# EAGLE design WG12864A (EAGLE 5.03)
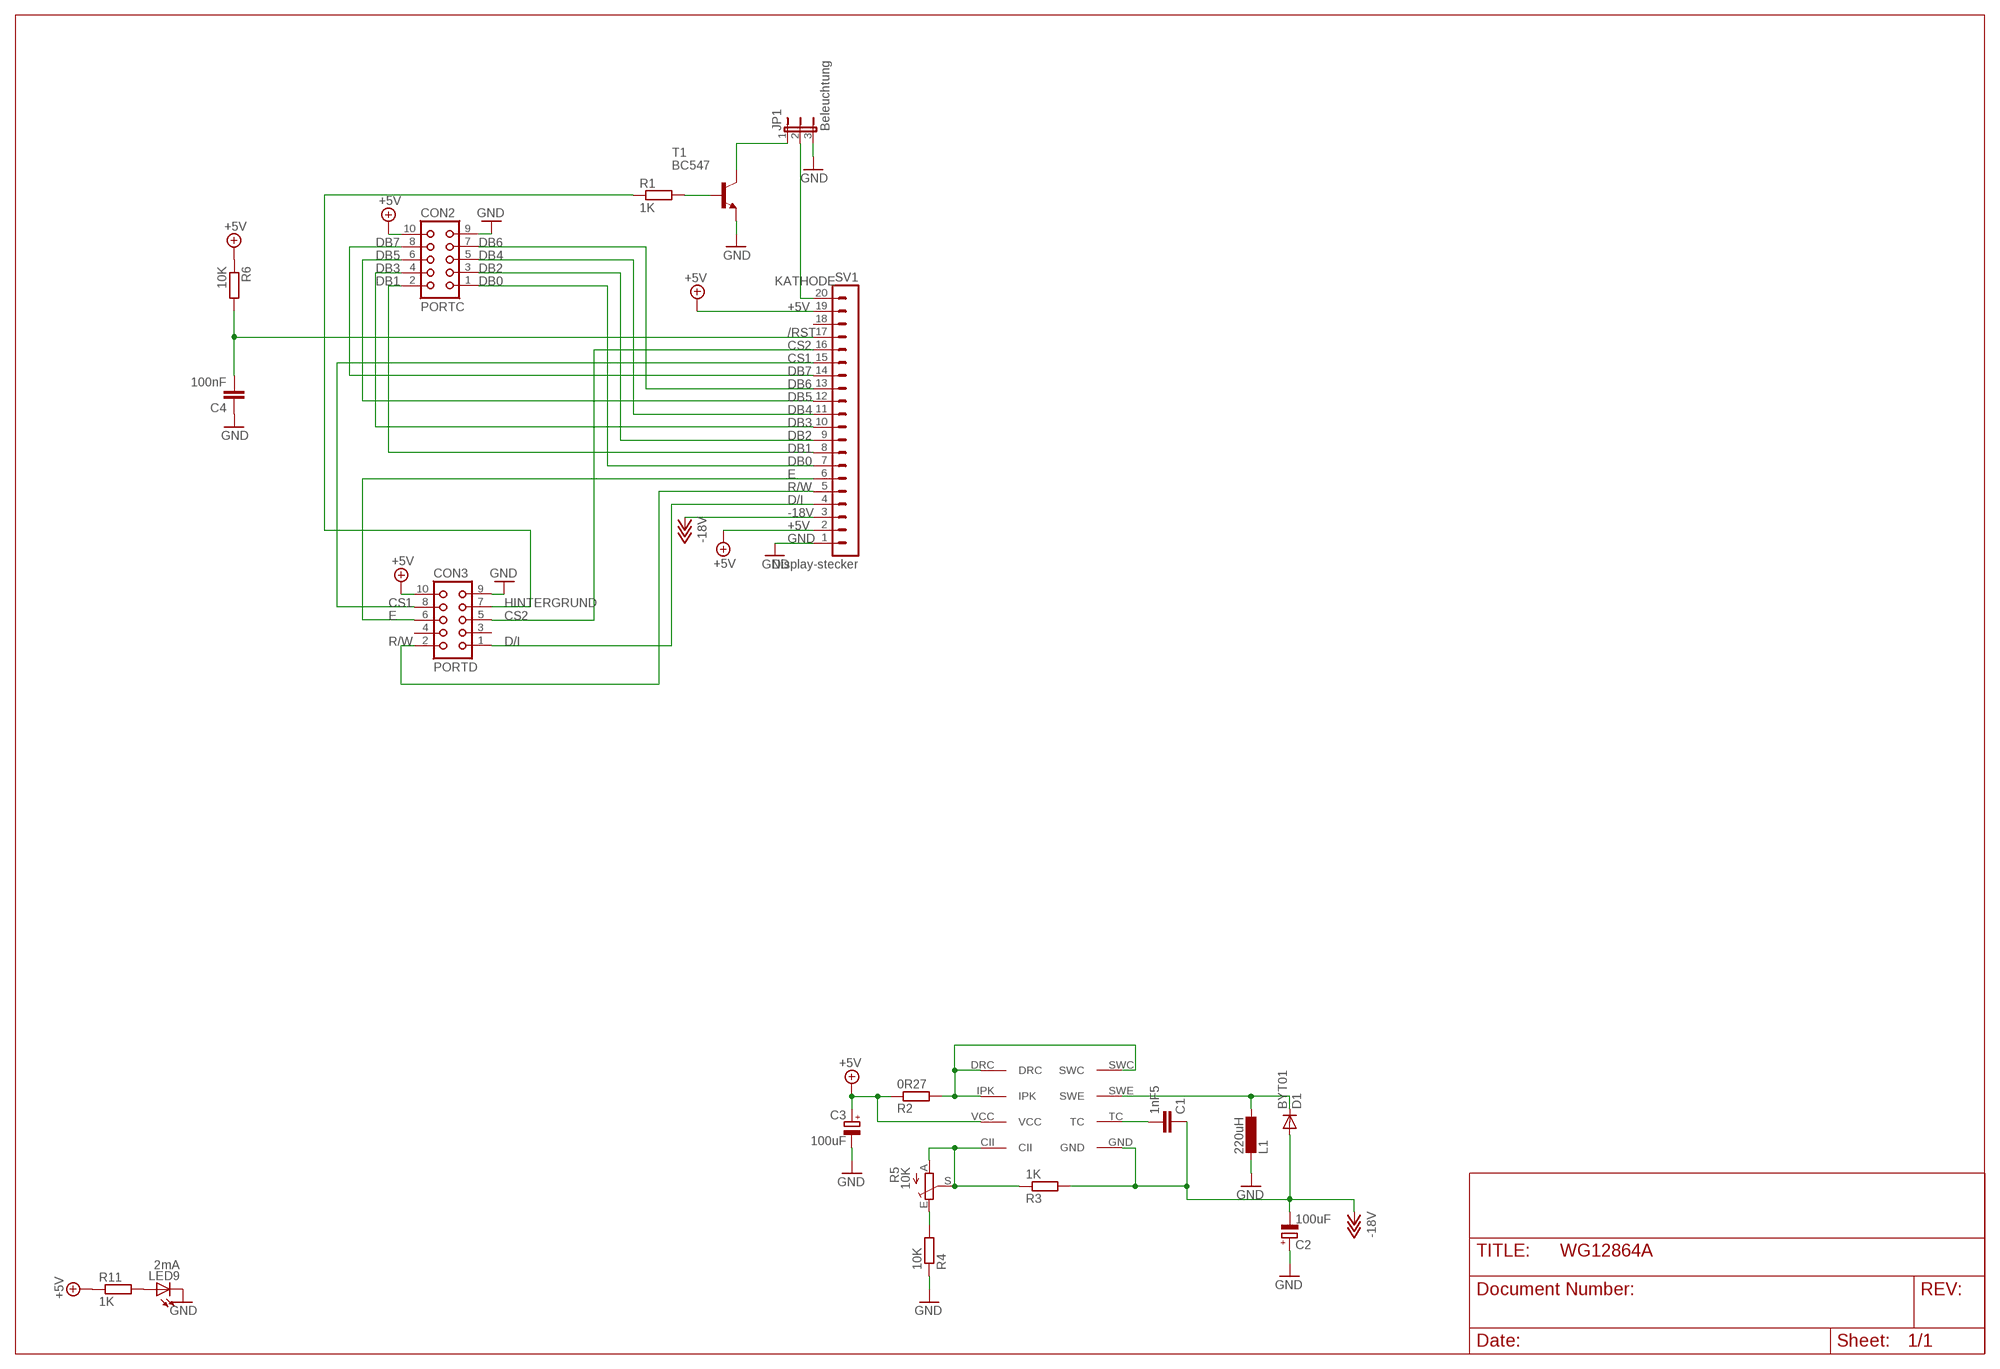
[diagram p0: schematic, sheet 1]

## Parts
C1  1nF5  C-EU025-024X044  [C025-024X044]
C2  100uF  CPOL-EUE5-8.5  [E5-8,5]
C3  100uF  CPOL-EUE5-8.5  [E5-8,5]
C4  100nF  C-EU025-024X044  [C025-024X044]
CON2  PORTC  CON10  [CON10]
CON3  PORTD  CON10  [CON10]
D1  BYT01  [F126-10]
JP1  Beleuchtung  JP2E  [JP2]
L1  220uH  L-EU0204/7  [0204/7]
LED9  2mA  LED3MM  [LED3MM]
R1  1K  R-EU_0204/7  [0204/7]
R2  0R27  R-EU_0204/7  [0204/7]
R3  1K  R-EU_0204/7  [0204/7]
R4  10K  R-EU_0204/7  [0204/7]
R5  10K  TRIM_EU-CA6V  [CA6V]
R6  10K  R-EU_0204/7  [0204/7]
R11  1K  R-EU_0204/2V  [0204V]
SV1  Display-stecker  MA20-1  [MA20-1]
T1  BC547  -NPN-TO92  [TO92]
U$2  MC34063  [MC34063]

## Nets
+5V: C3.+ CON2.10 CON3.10 R2.1 R6.1 R11.1 SV1.2 SV1.19 U$2.VCC
-18V: C1.1 C2.- D1.A R3.2 SV1.3 U$2.GND
/RST: C4.2 R6.2 SV1.17
CS1: CON3.8 SV1.15
CS2: CON3.5 SV1.16
D/I: CON3.1 SV1.4
DB0: CON2.1 SV1.7
DB1: CON2.2 SV1.8
DB2: CON2.3 SV1.9
DB3: CON2.4 SV1.10
DB4: CON2.5 SV1.11
DB5: CON2.6 SV1.12
DB6: CON2.7 SV1.13
DB7: CON2.8 SV1.14
E: CON3.6 SV1.6
GND: C2.+ C3.- C4.1 CON2.9 CON3.9 JP1.3 L1.2 LED9.K(C) R4.1 SV1.1 T1.1(E)
HINTERGRUND: CON3.7 R1.1
KATHODE: JP1.2 SV1.20
N$1: R1.2 T1.2(B)
N$3: LED9.A R11.2
N$21: R2.2 U$2.DRC U$2.IPK U$2.SWC
N$22: R3.1 R5.A R5.S U$2.CII
N$23: R4.2 R5.E
N$24: D1.C L1.1 U$2.SWE
N$25: C1.2 U$2.TC
N$30: JP1.1 T1.3(C)
R/W: CON3.2 SV1.5
Unconnected: CON3.3 CON3.4 SV1.18

## Library data of the parts
C1 C4 = rcl:C-EU: CAPACITOR, European symbol
C2 C3 = rcl:CPOL-EU: POLARIZED CAPACITOR, European symbol
CON2 CON3 = con-harting:CON10: CONNECTOR
D1 = diode:BYT01: DIODE ultra fast
JP1 = jumper:JP2E: JUMPER
L1 = rcl:L-EU: INDUCTOR, European symbol
LED9 = led:LED: LED OSRAM: - CHIPLED LG R971, LG N971, LY N971, LG Q971, LY Q971, LO R971, LY R971 LH N974, LH R974 LS Q976, LO Q976, LY Q976 LO Q996 - Hyper CHIPLED LW Q18S LB Q993, LB Q99A, LB R99A - SideLED LS A670, LO A670, LY A670, LG A670, LP A670 LB A673, LV A673, LT A673, LW A673 LH A674 LY A675 LS A676, LA A676, LO A676, LY A676, LW A676 LS A679, LY A679, LG A679 - Hyper Micro SIDELED® LS Y876, LA Y876, LO Y876, LY Y876 LT Y87S - SmartLED LW L88C, LW L88S LB L89C, LB L89S, LG L890 LS L89K, LO L89K, LY L89K LS L896, LA L896, LO L896, LY L896 - TOPLED LS T670, LO T670, LY T670, LG T670, LP T670 LSG T670, LSP T670, LSY T670, LOP T670, LYG T670 LG T671, LOG T671, LSG T671 LB T673, LV T673, LT T673, LW T673 LH T674 LS T676, LA T676, LO T676, LY T676, LB T676, LH T676, LSB T676, LW T676 LB T67C, LV T67C, LT T67C, LS T67K, LO T67K, LY T67K, LW E67C LS E67B, LA E67B, LO E67B, LY E67B, LB E67C, LV E67C, LT E67C LW T67C LS T679, LY T679, LG T679 LS T770, LO T770, LY T770, LG T770, LP T770 LB T773, LV T773, LT T773, LW T773 LH T774 LS E675, LA E675, LY E675, LS T675 LS T776, LA T776, LO T776, LY T776, LB T776 LHGB T686 LT T68C, LB T68C - Hyper Mini TOPLED® LB M676 - Mini TOPLED Santana® LG M470 LS M47K, LO M47K, LY M47K Source: http://www.osram.convergy.de LUXEON: - LUMILED® LXK2-PW12-R00, LXK2-PW12-S00, LXK2-PW14-U00, LXK2-PW14-V00 LXK2-PM12-R00, LXK2-PM12-S00, LXK2-PM14-U00 LXK2-PE12-Q00, LXK2-PE12-R00, LXK2-PE12-S00, LXK2-PE14-T00, LXK2-PE14-U00 LXK2-PB12-K00, LXK2-PB12-L00, LXK2-PB12-M00, LXK2-PB14-N00, LXK2-PB14-P00, LXK2-PB14-Q00 LXK2-PR12-L00, LXK2-PR12-M00, LXK2-PR14-Q00, LXK2-PR14-R00 LXK2-PD12-Q00, LXK2-PD12-R00, LXK2-PD12-S00 LXK2-PH12-R00, LXK2-PH12-S00 LXK2-PL12-P00, LXK2-PL12-Q00, LXK2-PL12-R00 Source: www.luxeon.com KINGBRIGHT: KA-3528ASYC Source: www.kingbright.com
R1-R4 R6 R11 = rcl:R-EU_: RESISTOR, European symbol
R5 = pot:TRIM_EU-: POTENTIOMETER
SV1 = con-lstb:MA20-1: PIN HEADER
T1 = transistor:*-NPN-: NPN Transistror
U$2 = ge01:MC34063

## Board
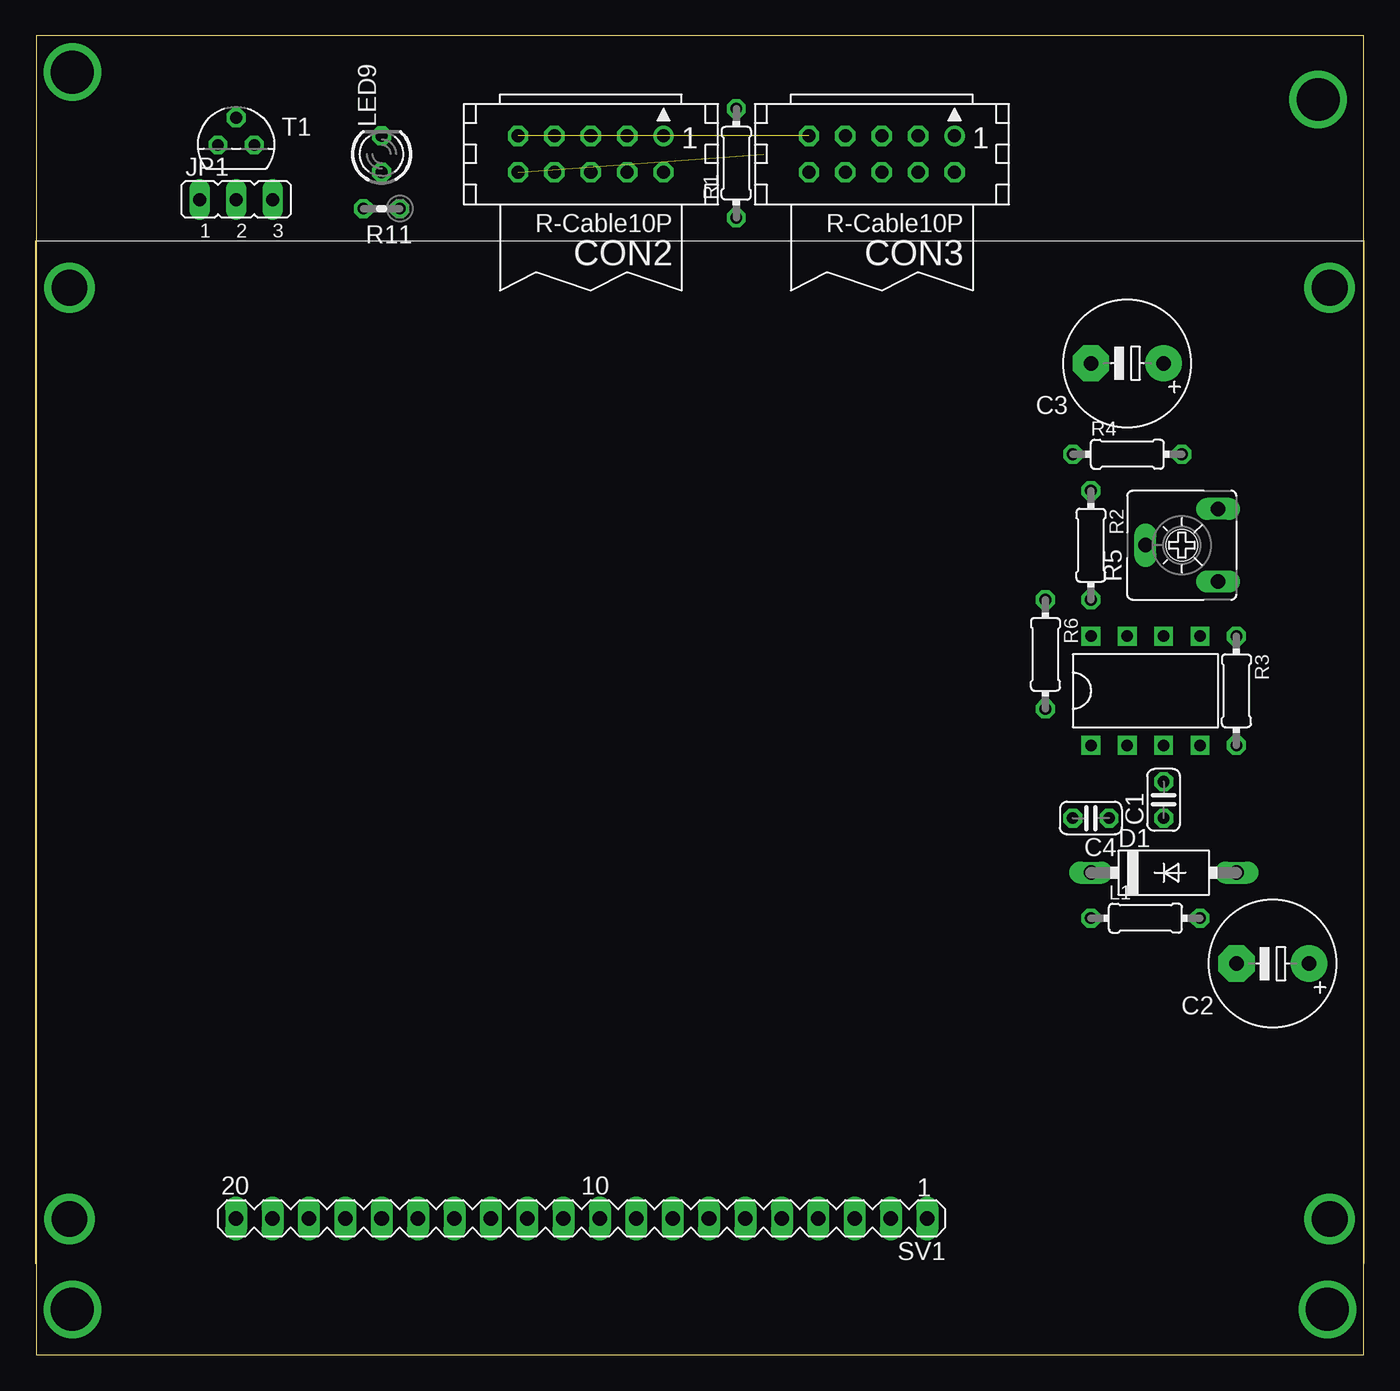
[diagram p1: board, top side]
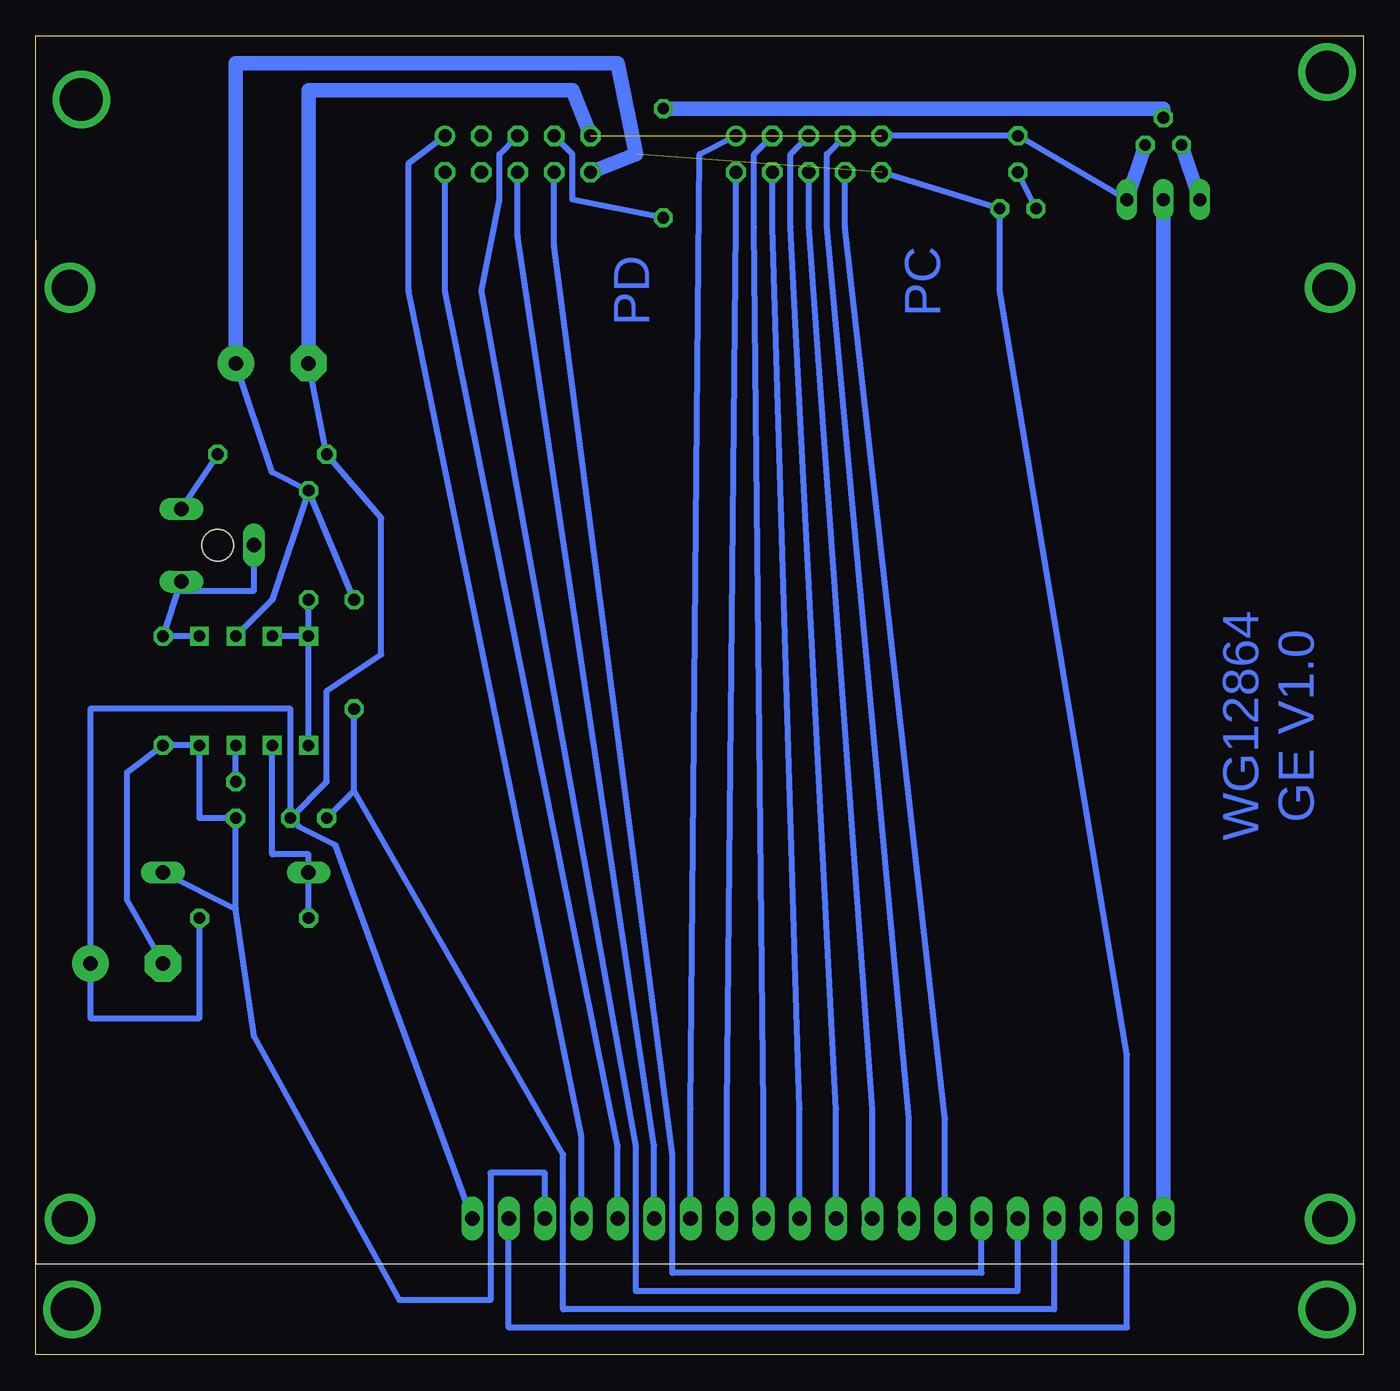
[diagram p2: board, bottom side, seen from below]

Size 92.73 x 92.08 mm. Coordinates in mm from the lower left corner, seen from the top.
Outline: 0,6.35 0,77.78
Outline: 92.73,77.78 92.73,6.35
Outline: 0.02,0 92.73,0 92.73,92.08 0.02,92.08 0.02,0
Copper layers (1*16): Top 0.035mm / dielectric 1.5mm / Bottom 0.035mm
Design rules "0.3mm": minimum track width 10mil, minimum drill 24mil, track to track 0.3mm, track to pad 0.3mm, pad to pad 0.3mm, via to via 0.3mm, smd to smd 0.3mm, copper to edge 40mil, drill to drill 8mil, minimum pad ring 10mil, minimum via ring 8mil, stop-mask expansion 4mil, vias tented up to drill 0mil, thermal gap 10mil
Holes 2.2 mm at 80.03,56.52

### Footprints (pad centres in the part's own frame; a part is rotated, then mirrored left to right if it is on the bottom)
C025-024X044 = drill 0.813 octagon: 1 -1.27,0; 2 1.27,0
E5-8,5 = drill 1.016 pad 2.54 round: + -2.54,0 | drill 1.016 pad 2.54 octagon: - 2.54,0
CON10 = drill 0.914 round: 1 -5.08,-1.27 | drill 0.914 octagon: 2 -5.08,1.27; 3 -2.54,-1.27; 4 -2.54,1.27; 5 0,-1.27; 6 0,1.27; 7 2.54,-1.27; 8 2.54,1.27; 9 5.08,-1.27; 10 5.08,1.27
F126-10 = drill 1.016 long: A 5.08,0; C -5.08,0
JP2 = drill 0.914 long: 1 -2.54,0; 2 0,0; 3 2.54,0
0204/7 = drill 0.813 octagon: 1 -3.81,0; 2 3.81,0
LED3MM = drill 0.813 octagon: A -1.27,0; K 1.27,0
CA6V = drill 1.016 long: A -2.54,-2.54; E 2.54,-2.54; S 0,2.54
0204V = drill 0.813 octagon: 1 -1.27,0; 2 1.27,0
MA20-1 = drill 1.016 long: 1 -24.13,0; 2 -21.59,0; 3 -19.05,0; 4 -16.51,0; 5 -13.97,0; 6 -11.43,0; 7 -8.89,0; 8 -6.35,0; 9 -3.81,0; 10 -1.27,0; 11 1.27,0; 12 3.81,0; 13 6.35,0; 14 8.89,0; 15 11.43,0; 16 13.97,0; 17 16.51,0; 18 19.05,0; 19 21.59,0; 20 24.13,0
TO92 = drill 0.813 octagon: 1 1.27,0; 2 0,1.905; 3 -1.27,0
MC34063 = drill 0.8 square: CII 7.62,7.62; DRC 0,7.62; GND 7.62,0; IPK 2.54,7.62; SWC 0,0; SWE 2.54,0; TC 5.08,0; VCC 5.08,7.62

### Placement (x,y rotation side)
C1  78.76,38.73 90 top
C2  86.38,27.3 180 top
C3  76.22,69.22 180 top
C4  73.68,37.47 180 top
CON2  38.76,83.82 180 top
CON3  59.08,83.82 180 top
D1  78.76,33.66 0 top
JP1  13.99,80.64 0 top
L1  77.49,30.48 0 top
LED9  24.15,83.82 90 top
R1  48.92,83.19 90 top
R2  73.68,56.52 270 top
R3  83.84,46.35 270 top
R4  76.22,62.87 0 top
R5  80.03,56.52 90 top
R6  70.5,48.9 270 top
R11  24.15,80.01 180 top
SV1  38.12,9.53 180 top
T1  13.99,84.45 0 top
U$2  73.68,42.55 0 top

### Tracks (layer width: path | path; a pad name or v marks a point on that pad's centre or on a via)
+5V  (1 unrouted)
  Bottom 0.406: R6.1 R2.1 | R2.1 76.22,61.59 C3.+ | R2.1 76.22,52.7 U$2.VCC | 16.53,1.91 SV1.19 | 16.53,1.91 59.71,1.91 SV1.2 | CON2.10 R11.1 25.42,74.3 16.53,20.95 16.53,1.91
  Bottom 1.016: CON3.10 50.82,83.82 52.09,90.17 78.76,90.17 C3.+
-18V
  Bottom 0.406: C2.- 86.38,31.75 86.38,40.64 R3.2 U$2.GND 81.3,37.47 C1.1 78.76,31.11 | 78.76,31.11 D1.A | SV1.3 57.17,12.7 60.98,12.7 60.98,3.81 67.33,3.81 77.49,22.23 78.76,31.11
/RST
  Bottom 0.406: 70.5,39.37 C4.2 | 70.5,39.37 R6.2 | 70.5,39.37 55.9,13.97 55.9,3.17 21.61,3.17 SV1.17
CS1
  Bottom 0.406: SV1.15 26.69,5.71 48.28,5.71 48.28,13.97 56.54,77.47 CON3.8
CS2
  Bottom 0.406: SV1.16 24.15,4.45 50.82,4.45 50.82,14.61 61.62,74.3 60.35,80.64 60.35,83.82 CON3.5
D/I
  Bottom 0.406: CON3.1 66.69,83.19 66.69,74.3 54.63,15.24 SV1.4
DB0
  Bottom 0.406: SV1.7 47.01,17.14 46.38,83.82 CON2.1
DB1
  Bottom 0.406: SV1.8 44.47,17.14 43.84,78.74 CON2.2
DB2
  Bottom 0.406: SV1.9 41.93,17.14 42.57,78.74 42.57,83.82 CON2.3
DB3
  Bottom 0.406: CON2.4 41.3,78.74 39.39,17.14 SV1.10
DB4
  Bottom 0.406: CON2.5 40.03,83.82 40.03,78.74 36.85,17.14 SV1.11
DB5
  Bottom 0.406: CON2.6 38.76,78.74 34.31,17.14 SV1.12
DB6
  Bottom 0.406: CON2.7 37.49,83.82 37.49,78.74 31.77,16.51 SV1.13
DB7
  Bottom 0.406: SV1.14 29.23,16.51 36.22,78.74 CON2.8
E
  Bottom 0.406: CON3.6 59.08,78.11 49.55,14.61 SV1.6
GND  (1 unrouted)
  Bottom 0.406: C3.- R4.1 68.6,58.42 68.6,48.9 72.41,46.35 72.41,40.01 C4.1 | L1.2 81.3,23.5 88.92,23.5 C2.+ 88.92,45.09 74.95,45.09 C4.1 | JP1.3 LED9.K CON2.9 | SV1.1 71.77,35.56 74.31,36.83 C4.1
  Bottom 1.016: JP1.3 T1.1 | CON3.9 55.27,88.27 73.68,88.27 C3.-
HINTERGRUND
  Bottom 0.406: R1.1 55.27,80.64 55.27,83.82 CON3.7
KATHODE
  Bottom 1.016: SV1.20 JP1.2
N$1
  Bottom 1.016: T1.2 13.99,87 R1.2
N$3
  Bottom 0.406: R11.2 LED9.A
N$17  (via drill 3)
  other vias: 2.56,3.17
N$18  (via drill 3)
  other vias: 2.56,89.53
N$19  (via drill 2.5)
  other vias: 90.35,74.48
N$20  (via drill 3)
  other vias: 89.55,87.63
N$21
  Bottom 0.406: U$2.DRC R2.2 | U$2.DRC U$2.IPK | U$2.SWC U$2.DRC
N$22
  Bottom 0.406: R5.S 77.49,53.34 82.57,53.34 R5.A R3.1 U$2.CII
N$23
  Bottom 0.406: R4.2 R5.E
N$24
  Bottom 0.406: U$2.SWE 76.22,34.92 73.68,34.92 L1.1 D1.C
N$25
  Bottom 0.406: C1.2 U$2.TC
N$27  (via drill 2.5)
  other vias: 2.35,74.48
N$28  (via drill 2.5)
  other vias: 2.35,9.48
N$30
  Bottom 1.016: JP1.1 T1.3
N$31  (via drill 2.5)
  other vias: 90.35,9.48
N$32  (via drill 3)
  other vias: 90.19,3.17
R/W
  Bottom 0.406: SV1.5 52.09,14.61 64.16,74.3 CON3.2

### Text on the board
Bottom: PC | PD | WG12864 | GE V1.0